# Altium schematic sheet VHFA_PA_DCDC.SchDoc: =MainTitle
size 420 x 297 mm; EDA_Number: ARTIQ; Projet: ARTIQ/SINARA; Author: G.Kasprowicz; CompanyName: WUT ISE; DrawnBy: G.Kasprowicz; Organization: WUT ISE; Address1: PW ISE; Address2: Nowowiejska 15/19 00-665 Warsaw; Address3: gkasprow@gmail.com; DocumentNumber: 5; Revision: 2; SheetNumber: 7; SheetTotal: 9; ModifiedBy: -; CheckedDate: -; Title2: Power Stage Supply; DivGrp: WUT ISE; Designer: G.Kasprowicz; ModifiedDate: -; ProjectName: Sensor Box
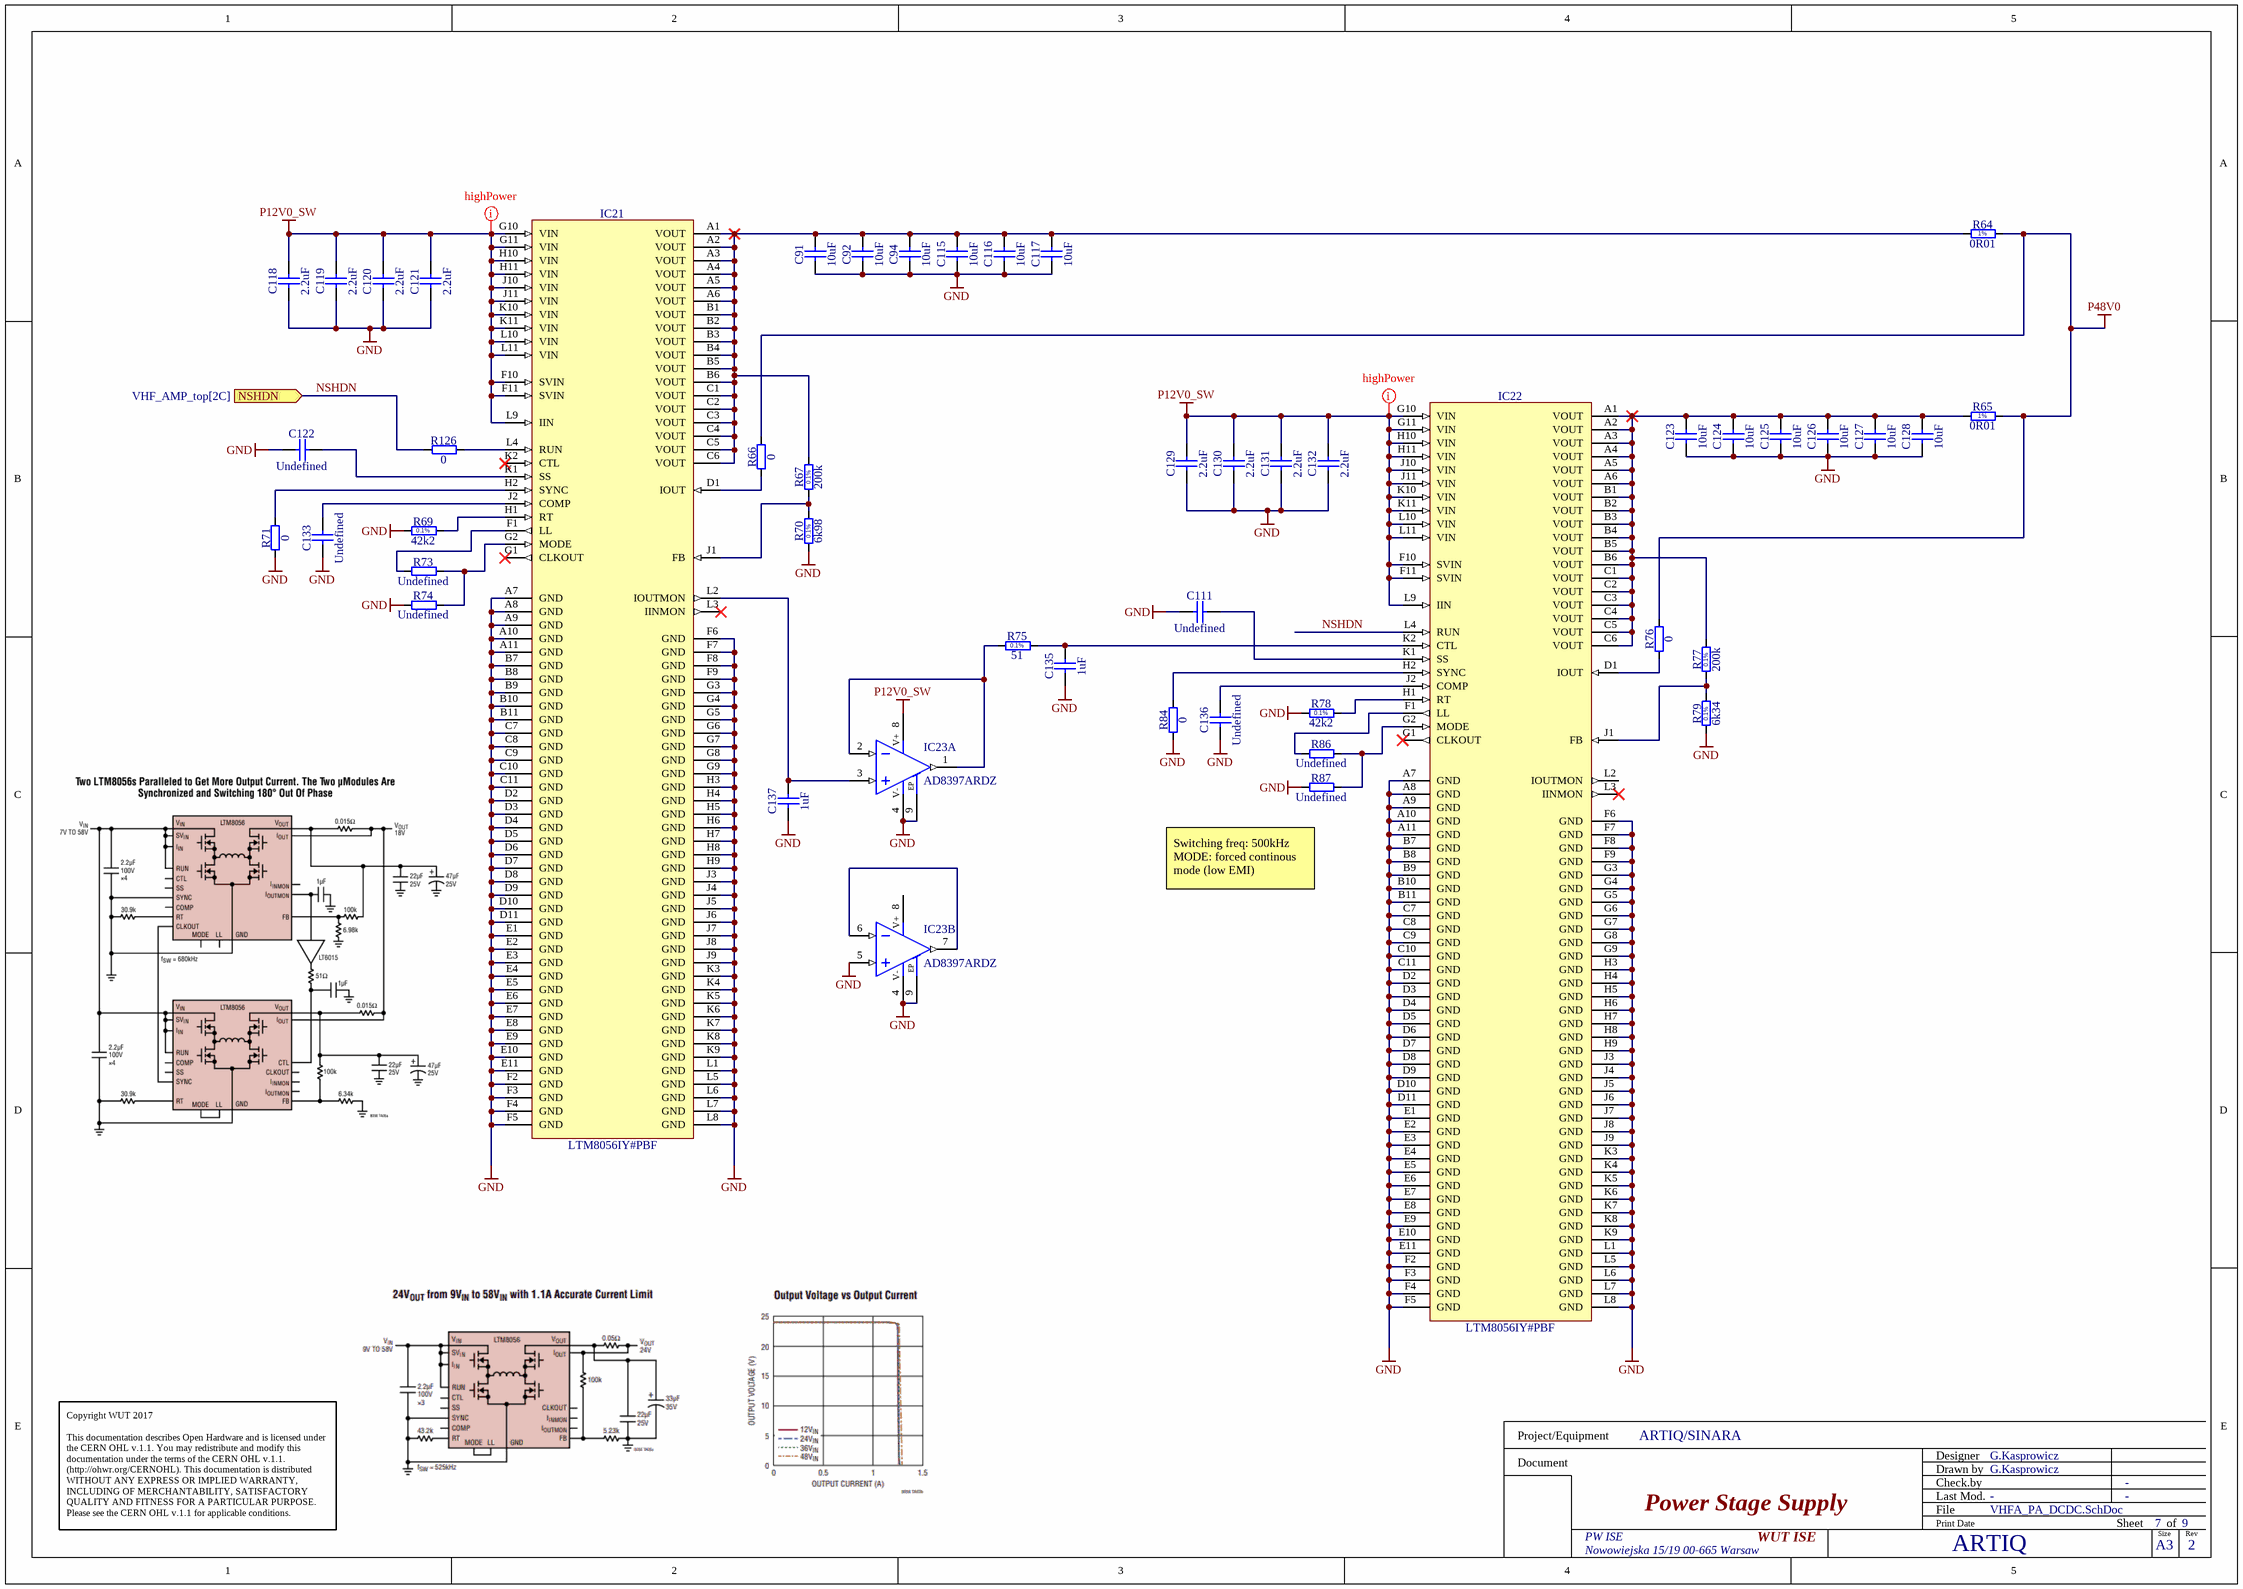
[diagram p0: VHFA_PA_DCDC.SchDoc]

## Parts
C91  10uF  [CAPC_TDK_CKG45N]
C92  10uF  [CAPC_TDK_CKG45N]
C94  10uF  [CAPC_TDK_CKG45N]
C111  Undefined  [CAPC1608X90N]
C115  10uF  [CAPC_TDK_CKG45N]
C116  10uF  [CAPC_TDK_CKG45N]
C117  10uF  [CAPC_TDK_CKG45N]
C118  2.2uF  [CAPC3216X180N]
C119  2.2uF  [CAPC3216X180N]
C120  2.2uF  [CAPC3216X180N]
C121  2.2uF  [CAPC3216X180N]
C122  Undefined  [CAPC1608X90N]
C123  10uF  [CAPC_TDK_CKG45N]
C124  10uF  [CAPC_TDK_CKG45N]
C125  10uF  [CAPC_TDK_CKG45N]
C126  10uF  [CAPC_TDK_CKG45N]
C127  10uF  [CAPC_TDK_CKG45N]
C128  10uF  [CAPC_TDK_CKG45N]
C129  2.2uF  [CAPC3216X180N]
C130  2.2uF  [CAPC3216X180N]
C131  2.2uF  [CAPC3216X180N]
C132  2.2uF  [CAPC3216X180N]
C133  Undefined  [CAPC1608X90N]
C135  1uF  [CAPC1608X87N]
C136  Undefined  [CAPC1608X90N]
C137  1uF  [CAPC1608X87N]
IC21  LTM8056IY#PBF  [BGA121C127P11X11_1500X1500X512]
IC22  LTM8056IY#PBF  [BGA121C127P11X11_1500X1500X512]
IC23  AD8397ARDZ  [SOIC127P600X175-9N-R241X309]  (parts A,B of 2)
R64  0R01  [RESC3216X80N]
R65  0R01  [RESC3216X80N]
R66  0  [RESC1608X55N]
R67  200k  [RESC1608X55N]
R69  42k2  [RESC1608X55N]
R70  6k98  [RESC1608X55N]
R71  0  [RESC1608X55N]
R73  Undefined  [RESC1608X55N]
R74  Undefined  [RESC1608X55N]
R75  51  [RESC1608X55N]
R76  0  [RESC1608X55N]
R77  200k  [RESC1608X55N]
R78  42k2  [RESC1608X55N]
R79  6k34  [RESC1608X55N]
R84  0  [RESC1608X55N]
R86  Undefined  [RESC1608X55N]
R87  Undefined  [RESC1608X55N]
R126  0  [RESC1608X55N]

## Ports
NSHDN (in, see VHF_AMP_top[2C])

## Nets
GND: C91.1 C92.1 C94.1 C111.1 C115.1 C116.1 C117.1 C118.1 C119.1 C120.1 C121.1 C122.1 C123.1 C124.1 C125.1 C126.1 C127.1 C128.1 C129.1 C130.1 C131.1 C132.1 C133.1 C135.1 C136.1 C137.1 IC21.A7(GND) IC21.A8(GND) IC21.A9(GND) IC21.A10(GND) IC21.A11(GND) IC21.B7(GND) IC21.B8(GND) IC21.B9(GND) IC21.B10(GND) IC21.B11(GND) IC21.C7(GND) IC21.C8(GND) IC21.C9(GND) IC21.C10(GND) IC21.C11(GND) IC21.D2(GND) IC21.D3(GND) IC21.D4(GND) IC21.D5(GND) IC21.D6(GND) IC21.D7(GND) IC21.D8(GND) IC21.D9(GND) IC21.D10(GND) IC21.D11(GND) IC21.E1(GND) IC21.E2(GND) IC21.E3(GND) IC21.E4(GND) IC21.E5(GND) IC21.E6(GND) IC21.E7(GND) IC21.E8(GND) IC21.E9(GND) IC21.E10(GND) IC21.E11(GND) IC21.F2(GND) IC21.F3(GND) IC21.F4(GND) IC21.F5(GND) IC21.F6(GND) IC21.F7(GND) IC21.F8(GND) IC21.F9(GND) IC21.G3(GND) IC21.G4(GND) IC21.G5(GND) IC21.G6(GND) IC21.G7(GND) IC21.G8(GND) IC21.G9(GND) IC21.H3(GND) IC21.H4(GND) IC21.H5(GND) IC21.H6(GND) IC21.H7(GND) IC21.H8(GND) IC21.H9(GND) IC21.J3(GND) IC21.J4(GND) IC21.J5(GND) IC21.J6(GND) IC21.J7(GND) IC21.J8(GND) IC21.J9(GND) IC21.K3(GND) IC21.K4(GND) IC21.K5(GND) IC21.K6(GND) IC21.K7(GND) IC21.K8(GND) IC21.K9(GND) IC21.L1(GND) IC21.L5(GND) IC21.L6(GND) IC21.L7(GND) IC21.L8(GND) IC22.A7(GND) IC22.A8(GND) IC22.A9(GND) IC22.A10(GND) IC22.A11(GND) IC22.B7(GND) IC22.B8(GND) IC22.B9(GND) IC22.B10(GND) IC22.B11(GND) IC22.C7(GND) IC22.C8(GND) IC22.C9(GND) IC22.C10(GND) IC22.C11(GND) IC22.D2(GND) IC22.D3(GND) IC22.D4(GND) IC22.D5(GND) IC22.D6(GND) IC22.D7(GND) IC22.D8(GND) IC22.D9(GND) IC22.D10(GND) IC22.D11(GND) IC22.E1(GND) IC22.E2(GND) IC22.E3(GND) IC22.E4(GND) IC22.E5(GND) IC22.E6(GND) IC22.E7(GND) IC22.E8(GND) IC22.E9(GND) IC22.E10(GND) IC22.E11(GND) IC22.F2(GND) IC22.F3(GND) IC22.F4(GND) IC22.F5(GND) IC22.F6(GND) IC22.F7(GND) IC22.F8(GND) IC22.F9(GND) IC22.G3(GND) IC22.G4(GND) IC22.G5(GND) IC22.G6(GND) IC22.G7(GND) IC22.G8(GND) IC22.G9(GND) IC22.H3(GND) IC22.H4(GND) IC22.H5(GND) IC22.H6(GND) IC22.H7(GND) IC22.H8(GND) IC22.H9(GND) IC22.J3(GND) IC22.J4(GND) IC22.J5(GND) IC22.J6(GND) IC22.J7(GND) IC22.J8(GND) IC22.J9(GND) IC22.K3(GND) IC22.K4(GND) IC22.K5(GND) IC22.K6(GND) IC22.K7(GND) IC22.K8(GND) IC22.K9(GND) IC22.L1(GND) IC22.L5(GND) IC22.L6(GND) IC22.L7(GND) IC22.L8(GND) IC23.4(V-) IC23.5(IN+) IC23.9(Exposed_Pad) R69.1 R70.1 R71.1 R74.1 R78.1 R79.1 R84.1 R87.1
P12V0_SW: C118.2 C119.2 C120.2 C121.2 C129.2 C130.2 C131.2 C132.2 IC21.F10(SVIN) IC21.F11(SVIN) IC21.G10(VIN) IC21.G11(VIN) IC21.H10(VIN) IC21.H11(VIN) IC21.J10(VIN) IC21.J11(VIN) IC21.K10(VIN) IC21.K11(VIN) IC21.L9(IIN) IC21.L10(VIN) IC21.L11(VIN) IC22.F10(SVIN) IC22.F11(SVIN) IC22.G10(VIN) IC22.G11(VIN) IC22.H10(VIN) IC22.H11(VIN) IC22.J10(VIN) IC22.J11(VIN) IC22.K10(VIN) IC22.K11(VIN) IC22.L9(IIN) IC22.L10(VIN) IC22.L11(VIN) IC23.8(V+)
P48V0: R64.2 R65.2 R66.2 R76.2
NSHDN: IC22.L4(RUN) R126.1 ; port NSHDN
NetC91_2: C91.2 C92.2 C94.2 C115.2 C116.2 C117.2 IC21.A1(VOUT) IC21.A2(VOUT) IC21.A3(VOUT) IC21.A4(VOUT) IC21.A5(VOUT) IC21.A6(VOUT) IC21.B1(VOUT) IC21.B2(VOUT) IC21.B3(VOUT) IC21.B4(VOUT) IC21.B5(VOUT) IC21.B6(VOUT) IC21.C1(VOUT) IC21.C2(VOUT) IC21.C3(VOUT) IC21.C4(VOUT) IC21.C5(VOUT) IC21.C6(VOUT) R64.1 R67.2
NetC111_2: C111.2 IC22.K1(SS)
NetC122_2: C122.2 IC21.K1(SS)
NetC123_2: C123.2 C124.2 C125.2 C126.2 C127.2 C128.2 IC22.A1(VOUT) IC22.A2(VOUT) IC22.A3(VOUT) IC22.A4(VOUT) IC22.A5(VOUT) IC22.A6(VOUT) IC22.B1(VOUT) IC22.B2(VOUT) IC22.B3(VOUT) IC22.B4(VOUT) IC22.B5(VOUT) IC22.B6(VOUT) IC22.C1(VOUT) IC22.C2(VOUT) IC22.C3(VOUT) IC22.C4(VOUT) IC22.C5(VOUT) IC22.C6(VOUT) R65.1 R77.2
NetC133_2: C133.2 IC21.J2(COMP)
NetC135_2: C135.2 IC22.K2(CTL) R75.2
NetC136_2: C136.2 IC22.J2(COMP)
NetC137_2: C137.2 IC21.L2(IOUTMON) IC23.3(IN+)
NetIC21_D1: IC21.D1(IOUT) R66.1
NetIC21_F1: IC21.F1(LL) R73.1
NetIC21_G2: IC21.G2(MODE) R73.2 R74.2
NetIC21_H1: IC21.H1(RT) R69.2
NetIC21_H2: IC21.H2(SYNC) R71.2
NetIC21_J1: IC21.J1(FB) R67.1 R70.2
NetIC21_L4: IC21.L4(RUN) R126.2
NetIC22_D1: IC22.D1(IOUT) R76.1
NetIC22_F1: IC22.F1(LL) R86.1
NetIC22_G2: IC22.G2(MODE) R86.2 R87.2
NetIC22_H1: IC22.H1(RT) R78.2
NetIC22_H2: IC22.H2(SYNC) R84.2
NetIC22_J1: IC22.J1(FB) R77.1 R79.2
NetIC23_1: IC23.1(OUT) IC23.2(IN-) R75.1
NetIC23_6: IC23.6(IN-) IC23.7(OUT)

Not connected (* = marked no-connect by the designer): IC21 G1(CLKOUT)* K2(CTL)* L3(IINMON)*; IC22 G1(CLKOUT)* L2(IOUTMON) L3(IINMON)*

## Layout directives
net class highPower: P12V0_SW

## Notes on the sheet
- (near R87) Switching freq: 500kHz
  MODE: forced continous mode (low EMI)
- Project/Equipment
- Document
- Designer
- Drawn by
- Check.by
- Copyright WUT 2017
  This documentation describes Open Hardware and is licensed under the CERN OHL v.1.1. You may redistribute and modify this documentation under the terms of the CERN OHL v.1.1. (http://ohwr.org/CERNOHL). This documentation is distributed WITHOUT ANY EXPRESS OR IMPLIED WARRANTY, INCLUDING OF MERCHANTABILITY, SATISFACTORY QUALITY AND FITNESS FOR A PARTICULAR PURPOSE. Please see the CERN OHL v.1.1 for applicable conditions.
- File
- Last Mod.
- Print Date
- Sheet
- Size
- A3
- of
- Rev
- (in symbol AD8397ARDZ, part A) EP
- (in symbol AD8397ARDZ, part B) EP
- (in symbol R0603_6K34_0.1%_0.063W_10PPM) 0.1%
- (in symbol R0603_6K98_0.1%_0.063W_10PPM) 0.1%
- (in symbol R0603_42K2_0.1%_0.063W_10PPM) 0.1%
- (in symbol R0603_51R_0.1%_0.063W_25PPM) 0.1%
- (in symbol R0603_200K_0.1%_0.063W_10PPM) 0.1%
- (in symbol R1206_0R01_1%_1W_100PPM_TT_LRMAM1206) 1%

## Library data of the parts
C91 C92 C94 C115-C117 C123-C128 = CC1812_10UF_100V_20%_X7S_TDK_CKG45N: Non-polarised capacitor; Part Description: Multilayer Ceramic Chip Capacitor - Stacked Cap, CKG45N Series; Manufacturer: TDK; Manufacturer Part Number: CKG45NX7S2A106M500JH; Voltage: 100V; TC: X7S; Tolerance: ±20%; Part Number: CC1812_10UF_100V_20%_X7S_TDK_CKG45N; Component Kind: Standard; Component Type: Standard; Pin Count: 2; Value: 10uF; Status: None; Case: 1812; Mounted: Yes; Socket: No; SMD: Yes; Sense: No; ComponentHeight: 5.5mm; HelpURL: \\cern.ch\dfs\Applications\Altium\Datasheets\CC1812_X7S_TDK_CKG.pdf; Author: CERN DEM MR; CreateDate: 14.12.2017; LatestRevisionDate: 14.12.2017
C111 C122 C133 C136 = CC0603_NO-VALUE: Non-polarised capacitor; Part Description: Reserved Footprint For 0603(1608) Chip Ceramic Capacitor; Mounted: No; Part Number: CC0603_NO-VALUE; Component Kind: Standard; Component Type: Standard; Pin Count: 2; Value: Undefined; Status: None; Manufacturer: Undefined; Manufacturer Part Number: CC0603_NO-VALUE; Case: 0603; Socket: No; SMD: Yes; Sense: No; Manufacturer1 ComponentHeight: 0.9mm; HelpURL: Undefined; Author: CERN DEM MR; CreateDate: 22.11.2016; LatestRevisionDate: 22.11.2016
C118-C121 C129-C132 = CC1206_2.2UF_50V_10%_X7R: Non-polarised capacitor; Part Description: SMD Multilayer Chip Ceramic Capacitor; Manufacturer: GENERIC; Manufacturer1 Part Number: C1206C225K5RACTU; Voltage: 50V; TC: X7R; Tolerance: ±10%; Part Number: CC1206_2.2UF_50V_10%_X7R; Component Kind: Standard; Component Type: Standard; Pin Count: 2; Value: 2.2uF; Status: Preferred; Manufacturer Part Number: CC1206_2.2uF_50V_10%_X7R; Case: 1206; Mounted: Yes; Socket: No; SMD: Yes; Sense: No; Manufacturer1 Example: KEMET; Manufacturer1 ComponentHeight: 1.8mm; HelpURL: \\cern.ch\dfs\Applications\Altium\Datasheets\CC1206_X7R_KEMET.pdf; Author: CERN DEM MR; CreateDate: 06.06.2016; LatestRevisionDate: 06.06.2016
C135 C137 = CC0603_1UF_25V_10%_X7R: Non-polarised capacitor; Part Description: SMD Multilayer Chip Ceramic Capacitor; Manufacturer: GENERIC; Manufacturer1 Part Number: GRM188R71E105KA12D; Voltage: 25V; TC: X7R; Tolerance: ±10%; Part Number: CC0603_1UF_25V_10%_X7R; Component Kind: Standard; Component Type: Standard; Pin Count: 2; Value: 1uF; Status: None; Manufacturer Part Number: CC0603_1UF_25V_10%_X7R; Case: 0603; Mounted: Yes; Socket: No; SMD: Yes; Sense: No; Manufacturer1 Example: MURATA; Manufacturer1 ComponentHeight: 0.9mm; HelpURL: \\cern.ch\dfs\Applications\Altium\Datasheets\CC0603_X7R_MURATA.pdf; Author: CERN DEM JLC; CreateDate: 18.01.2011; LatestRevisionDate: 18.01.2011
IC21 IC22 = LTM8056IY#PBF: 58VIN, 48VOUT Buck-Boost µModule Regulator; Manufacturer: LINEAR TECHNOLOGY; PressFit: No; Bonding: No; Part Number: LTM8056IY#PBF; Component Kind: Standard; Component Type: Standard; Device: LTM8056IY#PBF; PackageDescription: BGA,1.27mm Pitch, Square;121 Pin, 11 Columns X 11 Rows, 15.00mm X 15.00mm X 5.12mm H; Part Description: 58VIN, 48VOUT Buck-Boost µModule Regulator; Manufacturer Part Number: LTM8056IY#PBF; Pin Count: 121; Case: BGA121; Mounted: Yes; Socket: No; SMD: Yes; Sense: No; ComponentHeight: 5.12mm; HelpURL: \\cern.ch\dfs\Applications\Altium\Datasheets\LTM8056IY#PBF.pdf; Author: CERN DEM JLC; CreateDate: 08.04.2019; LatestRevisionDate: 08.04.2019
IC23 = AD8397ARDZ: Dual Operational Amplifier With Exposed Pad; Part Description: Rail-to-Rail, High Output Current Amplifier; Manufacturer: ANALOG DEVICES; PressFit: No; Bonding: No; Part Number: AD8397ARDZ; Component Kind: Standard; Component Type: Standard; Device: AD8397ARDZ; PackageDescription: SOIC 8, Pitch 1.27mm - Body 3.9x4.9mm, (w/thermal tab 2.41mm X 3.098mm), IPC Medium Density; Manufacturer Part Number: AD8397ARDZ; Pin Count: 9; Case: SOIC8; Mounted: Yes; Socket: No; SMD: Yes; Sense: No; ComponentHeight: 1.75mm; Author: CERN DEM JLC; HelpURL: \\cern.ch\dfs\Applications\Altium\Datasheets\AD8397ARDZ.pdf; CreateDate: 31.05.2011; LatestRevisionDate: 31.05.2011
R64 R65 = R1206_0R01_1%_1W_100PPM_TT_LRMAM1206: Resistor - 1%; Part Description: Low Value Metal Alloy Resistor; Manufacturer: TT Electronics; Manufacturer Part Number: LRMAM1206-R01FT5; Power: 1W; TC: ±100ppm/°C; PressFit: No; Part Number: R1206_0R01_1%_1W_100PPM_TT_LRMAM1206; Component Kind: Standard; Component Type: Standard; Pin Count: 2; Value: 0R01; Status: Not Recommended; Tolerance: ±1%; Case: 1206; Mounted: Yes; Sense: No; Socket: No; SMD: Yes; ComponentHeight: 0.8mm; HelpURL: \\cern.ch\dfs\Applications\Altium\Datasheets\R1206_TT ELECTRONICS_LRMA.pdf; Author: CERN DEM BC; CreateDate: 29.07.2015; LatestRevisionDate: 29.07.2015
R66 R71 R76 R84 R126 = R0603_0R_JUMPER: Resistor; Part Description: 1A (0.05R Max DC Resistance) Zero Ohm Jumper; Manufacturer: GENERIC; Manufacturer1 Part Number: NRC06Z0; PressFit: No; Part Number: R0603_0R_JUMPER; Component Kind: Standard; Component Type: Standard; Pin Count: 2; Value: 0; Status: Preferred; Manufacturer Part Number: R0603_0R_JUMPER; Case: 0603; Mounted: Yes; Sense: No; Socket: No; SMD: Yes; Manufacturer1 Example: NIC COMPONENT; Manufacturer1 ComponentHeight: 0.55mm; HelpURL: \\cern.ch\dfs\Applications\Altium\Datasheets\R0603_NIC_NRC.pdf; Author: CERN DEM JLC; CreateDate: 03.12.2007; LatestRevisionDate: 13.03.2008
R67 R77 = R0603_200K_0.1%_0.063W_10PPM: Resistor - 0.1%; Part Description: Thin Film Chip Resistor; Manufacturer: GENERIC; Manufacturer1 Part Number: RN73C1J200KBTDF; Power: 0.063W; TC: ±10ppm; PressFit: No; Part Number: R0603_200K_0.1%_0.063W_10PPM; Component Kind: Standard; Component Type: Standard; Pin Count: 2; Value: 200k; Status: Not Recommended; Tolerance: ±0.1%; Manufacturer Part Number: R0603_200K_0.1%_0.063W_10PPM; Case: 0603; Mounted: Yes; Sense: No; Socket: No; SMD: Yes; Manufacturer1 Example: TYCO HOLSWORTHY; Manufacturer1 ComponentHeight: 0.5mm; HelpURL: \\cern.ch\dfs\Applications\Altium\Datasheets\R0603_Tyco_RN73.pdf; Author: CERN DEM MR; CreateDate: 12.10.2017; LatestRevisionDate: 12.10.2017
R69 R78 = R0603_42K2_0.1%_0.063W_10PPM: Resistor - 0.1%; Part Description: Thin Film Chip Resistor; Manufacturer: GENERIC; Manufacturer1 Part Number: RN73C1J42K2BTDF; Power: 0.063W; TC: ±10ppm; PressFit: No; Part Number: R0603_42K2_0.1%_0.063W_10PPM; Component Kind: Standard; Component Type: Standard; Pin Count: 2; Value: 42k2; Status: Not Recommended; Tolerance: ±0.1%; Manufacturer Part Number: R0603_42K2_0.1%_0.063W_10PPM; Case: 0603; Mounted: Yes; Sense: No; Socket: No; SMD: Yes; Manufacturer1 Example: TYCO HOLSWORTHY; Manufacturer1 ComponentHeight: 0.5mm; HelpURL: \\cern.ch\dfs\Applications\Altium\Datasheets\R0603_Tyco_RN73.pdf; Author: CERN DEM JLC; CreateDate: 03.12.2007; LatestRevisionDate: 13.03.2008
R70 = R0603_6K98_0.1%_0.063W_10PPM: Resistor - 0.1%; Part Description: Thin Film Chip Resistor; Manufacturer: GENERIC; Manufacturer1 Part Number: RN73C1J6K98BTDF; Power: 0.063W; TC: ±10ppm; PressFit: No; Part Number: R0603_6K98_0.1%_0.063W_10PPM; Component Kind: Standard; Component Type: Standard; Pin Count: 2; Value: 6k98; Status: Not Recommended; Tolerance: ±0.1%; Manufacturer Part Number: R0603_6K98_0.1%_0.063W_10PPM; Case: 0603; Mounted: Yes; Sense: No; Socket: No; SMD: Yes; Manufacturer1 Example: TYCO HOLSWORTHY; Manufacturer1 ComponentHeight: 0.5mm; HelpURL: \\cern.ch\dfs\Applications\Altium\Datasheets\R0603_Tyco_RN73.pdf; Author: CERN DEM JLC; CreateDate: 03.12.2007; LatestRevisionDate: 13.03.2008
R73 R74 R86 R87 = R0603_NO-VALUE: Resistor; Part Description: Reserved Footprint For a 0603 (1608) Chip Resistor; PressFit: No; Mounted: No; Part Number: R0603_NO-VALUE; Component Kind: Standard; Component Type: Standard; Pin Count: 2; Value: Undefined; Status: None; Manufacturer: Undefined; Manufacturer Part Number: R0603_NO-VALUE; Case: 0603; Sense: No; Socket: No; SMD: Yes; Manufacturer1 Example: Undefined; Manufacturer1 Part Number: Undefined; Manufacturer1 ComponentHeight: Undefined; HelpURL: Undefined; Author: CERN DEM JLC; CreateDate: 03.12.2007; LatestRevisionDate: 13.03.2008
R75 = R0603_51R_0.1%_0.063W_25PPM: Resistor - 0.1%; Part Description: Thin Film Chip Resistor; Manufacturer: GENERIC; Manufacturer1 Part Number: CPF0603B51RE1; Power: 0.063W; TC: ±25ppm; PressFit: No; Part Number: R0603_51R_0.1%_0.063W_25PPM; Component Kind: Standard; Component Type: Standard; Pin Count: 2; Value: 51; Status: Not Recommended; Tolerance: ±0.1%; Manufacturer Part Number: R0603_51R_0.1%_0.063W_25PPM; Case: 0603; Mounted: Yes; Sense: No; Socket: No; SMD: Yes; Manufacturer1 Example: TE CONNECTIVITY; Manufacturer1 ComponentHeight: 0.55mm; HelpURL: \\cern.ch\dfs\Applications\Altium\Datasheets\R0603_TYCO_CPF.pdf; Author: CERN DEM JLC; CreateDate: 12.01.2017; LatestRevisionDate: 12.01.2017
R79 = R0603_6K34_0.1%_0.063W_10PPM: Resistor - 0.1%; Part Description: Thin Film Chip Resistor; Manufacturer: GENERIC; Manufacturer1 Part Number: RN73C1J6K34BTDF; Power: 0.063W; TC: ±10ppm; PressFit: No; Part Number: R0603_6K34_0.1%_0.063W_10PPM; Component Kind: Standard; Component Type: Standard; Pin Count: 2; Value: 6k34; Status: Not Recommended; Tolerance: ±0.1%; Manufacturer Part Number: R0603_6K34_0.1%_0.063W_10PPM; Case: 0603; Mounted: Yes; Sense: No; Socket: No; SMD: Yes; Manufacturer1 Example: TYCO HOLSWORTHY; Manufacturer1 ComponentHeight: 0.5mm; HelpURL: \\cern.ch\dfs\Applications\Altium\Datasheets\R0603_Tyco_RN73.pdf; Author: CERN DEM JLC; CreateDate: 03.12.2007; LatestRevisionDate: 13.03.2008